# Altium schematic sheet RF_AMP.SchDoc
size 431 x 279 mm
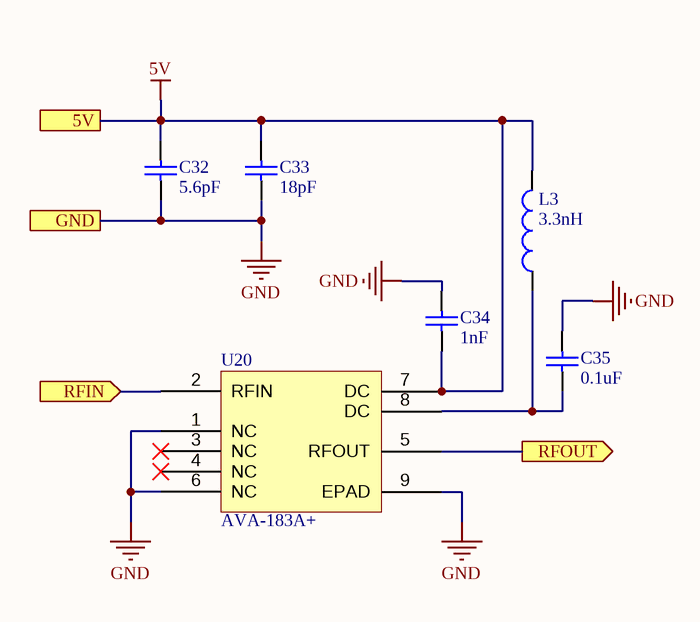
[diagram p0: RF_AMP.SchDoc]

## Parts
C32  5.6pF  [SMD-0402]
C33  18pF  [SMD-0402]
C34  1nF  [SMD-0402]
C35  0.1uF  [SMD-0402]
L3  3.3nH  [SMD-0805]
U20  AVA-183A+  [AVA-183A+ QFN]

## Ports
5V, GND, RFIN (in), RFOUT (out)

## Nets
5V: C32.2 C33.2 C34.1 L3.2 U20.7(DC) ; port 5V
GND: C32.1 C33.1 C34.2 C35.2 U20.1(NC) U20.6(NC) U20.9(EPAD) ; port GND
RFIN: U20.2(RFIN) ; port RFIN
RFOUT: U20.5(RFOUT) ; port RFOUT
NetC35_1: C35.1 L3.1 U20.8(DC)

Not connected (* = marked no-connect by the designer): U20 3(NC)* 4(NC)*

## Notes on the sheet
- DWG. NO.
- REV.
- SHT.
- THIS DOCUMENT AND THE DATA DISCLOSED HEREIN OR HEREWITH IS THE PROPERTY OF ALTIUM LIMITED AND MAY BE FREELY DISTRIBUTED IN WHOLE. NO RIGHTS ARE RESERVED OR EXPRESS OR IMPLIED WARANTEE GIVEN.
- REVISION
- DESCRIPTION
- DATE
- APPROVED
- ENG:
- APPROVALS
- PROJECT
- DSN:
- CHK:
- REFERENCE DOCUMENTS
- PROJECT REVISION:
- TITLE
- DOCUMENT REVISION:
- DESIGN ITEM:
- BOM:
- FAB DWG:
- PCB DWG:
- ASSY DWG:
- SCALE:
- SIZE
- B
- CAGE CODE
- FILE NAME
- DWG NO.
- SHEET
- OF
- REV

## Library data of the parts
C32-C35 = CAP0402: Ceramic Capacitor 0402
L3 = L0805: Inductor 0805
U20 = AVA-183A+: Wideband, Microwave, Monolithic Amplifier, 50Ω, 5 to 18 GHz